# EAGLE design XCOMBO_A (EAGLE 9.1.3)
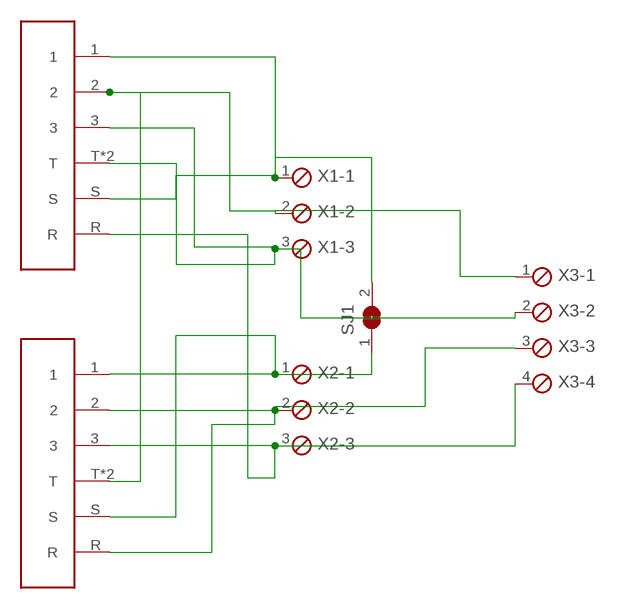
[diagram p0: schematic, sheet 1]

## Parts
SJ1  SJ  [SJ]
U$1  XLRCOMBOTYPEA  [NCJ6FA-V-0]
U$2  XLRCOMBOTYPEA  [NCJ6FA-V-0]
X1  MPT3  [3POL254]
X2  MPT3  [3POL254]
X3  MPT4  [4POL254]

## Nets
L+: U$1.T U$1.T2(T) U$2.2 X1.2 X3.1
L-: U$2.3 U$2.T U$2.T2(T) X1.3 X3.2
LG: SJ1.2 U$2.1 U$2.S X1.1
R+: U$1.2 U$1.R X2.2 X3.3
R-: U$1.3 U$2.R X2.3 X3.4
RG: SJ1.1 U$1.1 U$1.S X2.1

## Library data of the parts
SJ1 = jumper:SJ: SMD solder JUMPER
U$1 U$2 = Vwvwbg:XLRCOMBO
X1 X2 = con-phoenix-254:MPT3: PHOENIX CONNECTOR; OC_FARNELL: unknown; OC_NEWARK: unknown
X3 = con-phoenix-254:MPT4: PHOENIX CONNECTOR; OC_FARNELL: unknown; OC_NEWARK: unknown

## Board
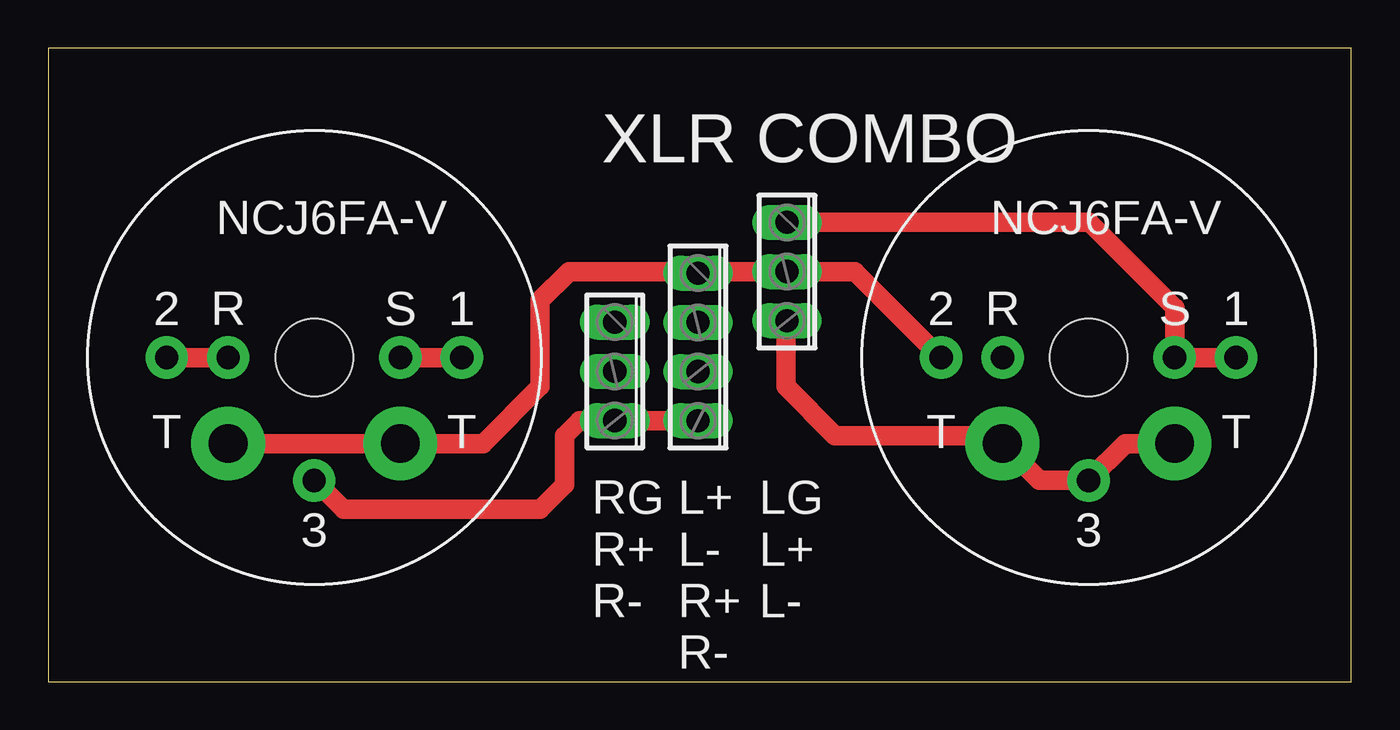
[diagram p1: board, top side]
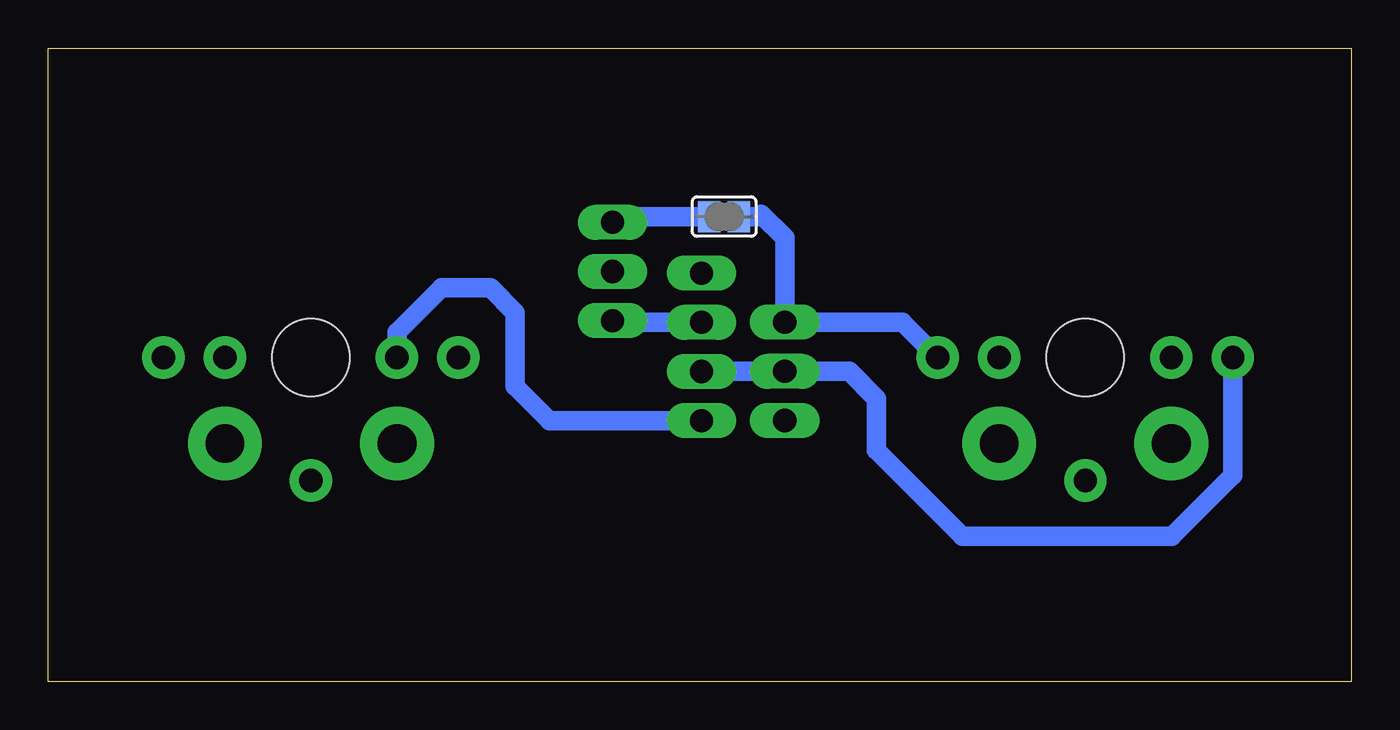
[diagram p2: board, bottom side, seen from below]

Size 67.29 x 32.69 mm. Coordinates in mm from the lower left corner, seen from the top.
Outline: 0,0 67.29,0 67.29,32.69 0,32.69 0,0
Copper layers (1*16): Top 0.035mm / dielectric 1.5mm / Bottom 0.035mm
Design rules "default": minimum track width 6mil, minimum drill 0.3mm, track to track 7mil, track to pad 7mil, pad to pad 7mil, via to via 7mil, smd to smd 7mil, copper to edge 8mil, drill to drill 8mil, minimum pad ring 6mil, minimum via ring 6mil, stop-mask expansion 4mil, vias tented up to drill 0mil, thermal gap 10mil

### Footprints (pad centres in the part's own frame; a part is rotated, then mirrored left to right if it is on the bottom)
SJ = smd 1.168 x 1.6: 1 -0.762,0; 2 0.762,0
NCJ6FA-V-0 = drill 1.2 pad 2.184: 1 7.62,0; 2 -7.62,0; 3 0,-6.35; R -4.445,0; S 4.445,0 | drill 2 pad 3.81: T -4.45,-4.445; T2 4.445,-4.445 | hole 4: 0,0
3POL254 = drill 1.2 long: 1 -2.54,0; 2 0,0; 3 2.54,0
4POL254 = drill 1.2 long: 1 -3.81,0; 2 -1.27,0; 3 1.27,0; 4 3.81,0

### Placement (x,y rotation side)
SJ1  32.38,24 180 bottom
U$1  13.73,16.73 0 top
U$2  53.73,16.73 0 top
X1  38.15,21.17 270 top
X2  29.25,16.02 270 top
X3  33.55,17.28 270 top

### Tracks (layer width: path | path; a pad name or v marks a point on that pad's centre or on a via)
L+
  Top 1.016: U$1.T U$1.T2 22.45,12.29 25.4,15.24 25.4,19.68 26.88,21.17 33.63,21.17 | U$2.2 41.67,21.17 X1.2 33.63,21.17 | 33.63,21.17 X3.1
L-
  Top 1.016: U$2.T2 55.63,12.29 U$2.3 51.19,10.38 U$2.T 48.87,12.7 40.64,12.7 38.1,15.24 38.1,18.58 X1.3
  Bottom 1.016: X3.2 38.07,18.55 X1.3
LG
  Top 1.016: X1.1 53.76,23.71 58.17,19.3 U$2.S U$2.1
  Bottom 1.016: SJ1.2 37.86,24 X1.1
R+
  Top 1.016: U$1.2 U$1.R
  Bottom 1.016: X3.3 X2.2 25.92,16.02 24.51,14.61 24.51,11.94 20.07,7.49 9.27,7.49 6.11,10.65 U$1.2
R-
  Top 1.016: U$1.3 13.75,10.38 15.24,8.89 25.4,8.89 26.67,10.16 26.67,12.7 27.45,13.48 X2.3 29.26,13.47 X3.4
  Bottom 1.016: U$2.R 49.28,18.02 46.99,20.32 44.45,20.32 43.18,19.05 43.18,15.24 41.41,13.47 X3.4
RG
  Top 1.016: U$1.S U$1.1
  Bottom 1.016: SJ1.1 30.61,24 30.48,24.13 29.25,22.9 X2.1 23.18,18.56 U$1.1

### Text on the board
tPlace: XLR COMBO | RG / R+ / R- | LG / L+ / L- | L+ / L- / R+ / R-